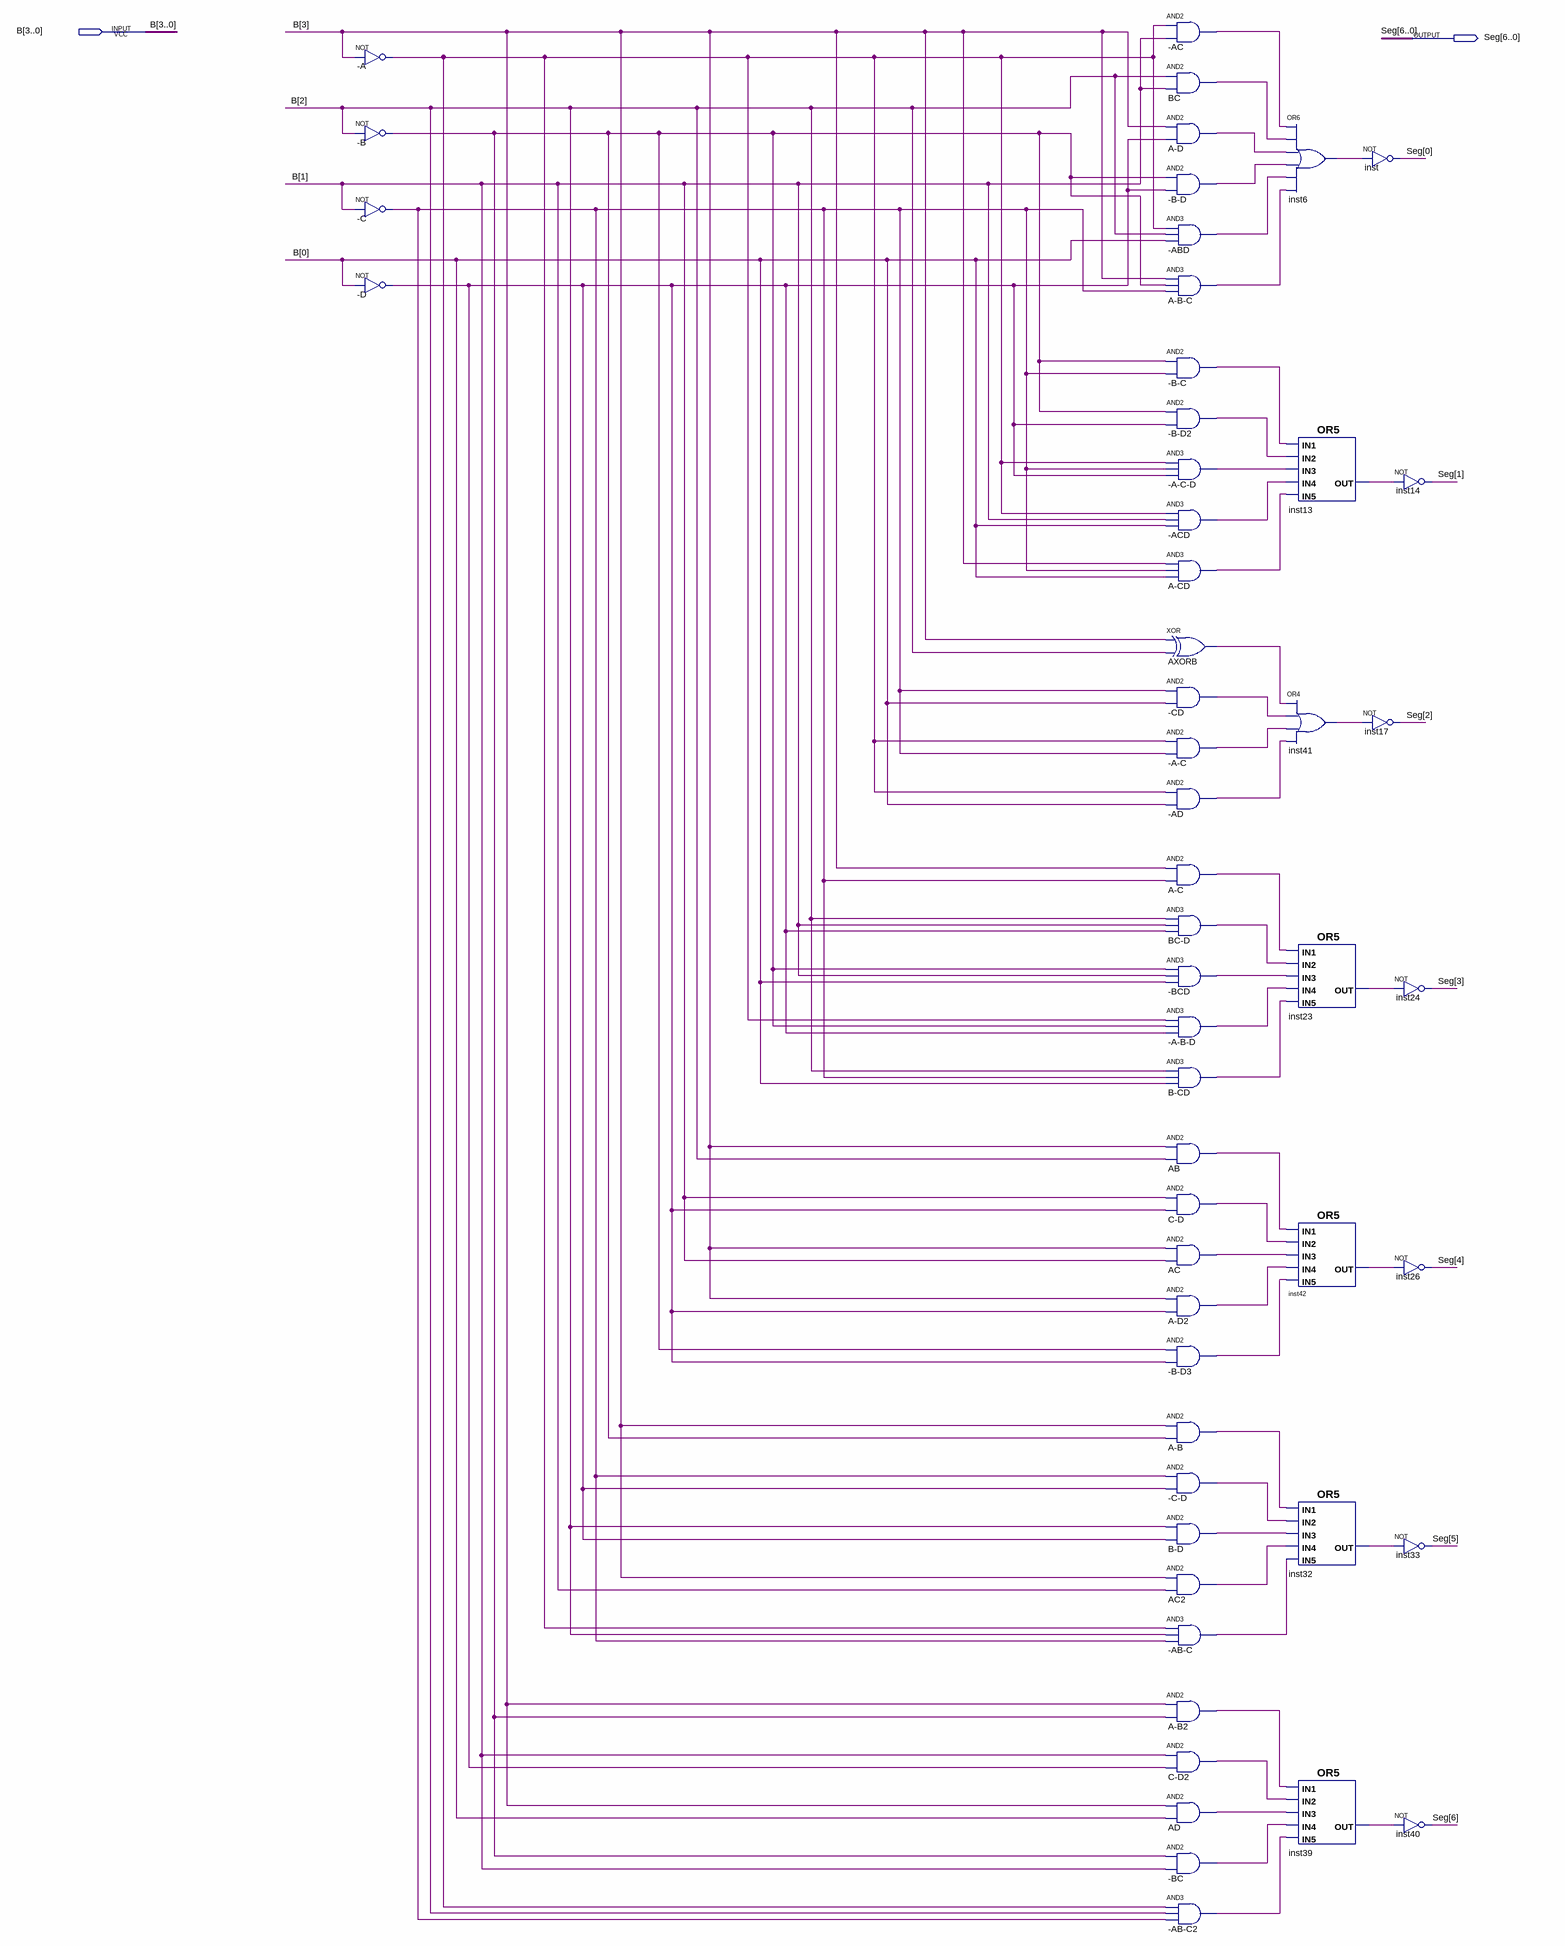
[diagram p0: schematic sheet]
// Quartus schematic Display.bdf as structural Verilog: 53 symbols, 2 pins
module Display (
  input  [3:0] B,
  output [6:0] Seg
);

  wire _A_B_D_out, _A_C_D_out, _A_C_out, _A_out, _AB_C2_out, _AB_C_out, _ABD_out, _AC_out, _ACD_out, _AD_out,
       _B_C_out, _B_D2_out, _B_D3_out, _B_D_out, _B_out, _BC_out, _BCD_out, _C_D_out, _C_out, _CD_out,
       _D_out, A_B2_out, A_B_C_out, A_B_out, A_C_out, A_CD_out, A_D2_out, A_D_out, AB_out, AC2_out, AC_out,
       AD_out, AXORB_out, B_CD_out, B_D_out, BC_D_out, BC_out, C_D2_out, C_D_out, inst6_out, inst13_out,
       inst23_out, inst32_out, inst39_out, inst41_out, inst42_out;

  not \u_-A  (_A_out, B[3]);
  not \u_-B  (_B_out, B[2]);
  not \u_-C  (_C_out, B[1]);
  not \u_-D  (_D_out, B[0]);
  and \u_-AC  (_AC_out, _A_out, B[1]);
  and BC (BC_out, B[2], B[1]);
  and \A-D  (A_D_out, B[3], _D_out);
  and \u_-B-D  (_B_D_out, _B_out, _D_out);
  and \u_-ABD  (_ABD_out, _A_out, B[2], B[0]);
  and \A-B-C  (A_B_C_out, B[3], _B_out, _C_out);
  and \u_-B-C  (_B_C_out, _B_out, _C_out);
  and \u_-B-D2  (_B_D2_out, _B_out, _D_out);
  and \u_-A-C-D  (_A_C_D_out, _A_out, _C_out, _D_out);
  and \u_-ACD  (_ACD_out, _A_out, B[1], B[0]);
  and \A-CD  (A_CD_out, B[3], _C_out, B[0]);
  xor AXORB (AXORB_out, B[3], B[2]);
  and \u_-CD  (_CD_out, _C_out, B[0]);
  and \u_-A-C  (_A_C_out, _A_out, _C_out);
  and \u_-AD  (_AD_out, _A_out, B[0]);
  and \A-C  (A_C_out, B[3], _C_out);
  and \BC-D  (BC_D_out, B[2], B[1], _D_out);
  and \u_-BCD  (_BCD_out, _B_out, B[1], B[0]);
  and \u_-A-B-D  (_A_B_D_out, _A_out, _B_out, _D_out);
  and \B-CD  (B_CD_out, B[2], _C_out, B[0]);
  and AB (AB_out, B[3], B[2]);
  and \C-D  (C_D_out, B[1], _D_out);
  and AC (AC_out, B[3], B[1]);
  and \A-D2  (A_D2_out, B[3], _D_out);
  and \u_-B-D3  (_B_D3_out, _B_out, _D_out);
  and \A-B  (A_B_out, B[3], _B_out);
  and \u_-C-D  (_C_D_out, _C_out, _D_out);
  and \B-D  (B_D_out, B[2], _D_out);
  and AC2 (AC2_out, B[3], B[1]);
  and \u_-AB-C  (_AB_C_out, _A_out, B[2], _C_out);
  and \A-B2  (A_B2_out, B[3], _B_out);
  and \C-D2  (C_D2_out, B[1], _D_out);
  and AD (AD_out, B[3], B[0]);
  and \u_-BC  (_BC_out, _B_out, B[1]);
  and \u_-AB-C2  (_AB_C2_out, _A_out, B[2], _C_out);
  or inst6 (inst6_out, _AC_out, BC_out, A_D_out, _B_D_out, _ABD_out, A_B_C_out);
  or inst13 (inst13_out, _B_C_out, _B_D2_out, _A_C_D_out, _ACD_out, A_CD_out);
  or inst41 (inst41_out, AXORB_out, _CD_out, _A_C_out, _AD_out);
  or inst23 (inst23_out, A_C_out, BC_D_out, _BCD_out, _A_B_D_out, B_CD_out);
  or inst42 (inst42_out, AB_out, C_D_out, AC_out, A_D2_out, _B_D3_out);
  or inst32 (inst32_out, A_B_out, _C_D_out, B_D_out, AC2_out, _AB_C_out);
  or inst39 (inst39_out, A_B2_out, C_D2_out, AD_out, _BC_out, _AB_C2_out);
  not inst (Seg[0], inst6_out);
  not inst14 (Seg[1], inst13_out);
  not inst17 (Seg[2], inst41_out);
  not inst24 (Seg[3], inst23_out);
  not inst26 (Seg[4], inst42_out);
  not inst33 (Seg[5], inst32_out);
  not inst40 (Seg[6], inst39_out);
endmodule
